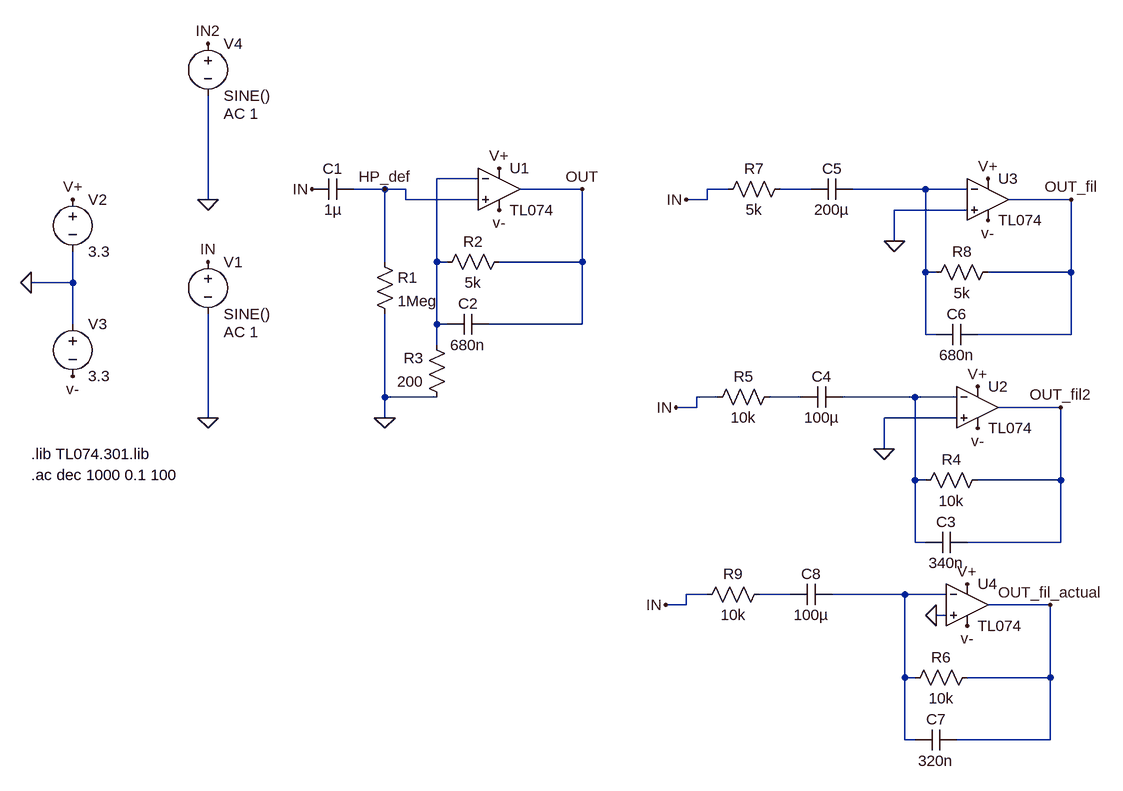
[diagram p0: schematic capstone_filter_only.asc]
capstone_filter_only.asc, the LTspice schematic file:
Version 4
SHEET 1 1804 912
WIRE 272 0 208 0
WIRE 128 16 80 16
WIRE 160 16 128 16
WIRE 432 16 336 16
WIRE 656 16 624 16
WIRE 784 16 736 16
WIRE 960 16 848 16
WIRE 1024 16 960 16
WIRE -144 32 -144 -128
WIRE 160 32 160 16
WIRE 272 32 160 32
WIRE 624 32 624 16
WIRE 624 32 592 32
WIRE 1184 32 1088 32
WIRE 1024 48 912 48
WIRE 912 96 912 48
WIRE 128 128 128 16
WIRE 208 128 208 0
WIRE 224 128 208 128
WIRE 432 128 432 16
WIRE 432 128 304 128
WIRE 960 144 960 16
WIRE 976 144 960 144
WIRE 1184 144 1184 32
WIRE 1184 144 1056 144
WIRE -352 160 -352 112
WIRE -352 160 -416 160
WIRE -352 224 -352 160
WIRE 208 224 208 128
WIRE 224 224 208 224
WIRE 432 224 432 128
WIRE 432 224 288 224
WIRE 960 240 960 144
WIRE 976 240 960 240
WIRE 1184 240 1184 144
WIRE 1184 240 1040 240
WIRE 208 256 208 224
WIRE 128 336 128 208
WIRE 208 336 128 336
WIRE 640 336 608 336
WIRE 768 336 720 336
WIRE 944 336 832 336
WIRE 1008 336 944 336
WIRE 608 352 608 336
WIRE 608 352 576 352
WIRE 1168 352 1072 352
WIRE -144 368 -144 208
WIRE 128 368 128 336
WIRE 1008 368 896 368
WIRE 896 416 896 368
WIRE 944 464 944 336
WIRE 960 464 944 464
WIRE 1168 464 1168 352
WIRE 1168 464 1040 464
WIRE 944 560 944 464
WIRE 960 560 944 560
WIRE 1168 560 1168 464
WIRE 1168 560 1024 560
WIRE 624 640 592 640
WIRE 752 640 704 640
WIRE 928 640 816 640
WIRE 992 640 928 640
WIRE 592 656 592 640
WIRE 592 656 560 656
WIRE 1152 656 1056 656
WIRE 992 672 976 672
WIRE 928 768 928 640
WIRE 944 768 928 768
WIRE 1152 768 1152 656
WIRE 1152 768 1024 768
WIRE 928 864 928 768
WIRE 944 864 928 864
WIRE 1152 864 1152 768
WIRE 1152 864 1008 864
FLAG 304 -16 V+
FLAG 304 48 v-
FLAG 432 16 OUT
FLAG -144 368 0
FLAG -416 160 0
FLAG -352 32 V+
FLAG -352 304 v-
FLAG -144 128 IN
FLAG 16 16 IN
FLAG 128 368 0
FLAG 1056 0 V+
FLAG 1056 64 v-
FLAG 1184 32 OUT_fil
FLAG 592 32 IN
FLAG 128 16 HP_def
FLAG -144 32 0
FLAG -144 -208 IN2
FLAG 912 96 0
FLAG 1040 320 V+
FLAG 1040 384 v-
FLAG 1168 352 OUT_fil2
FLAG 576 352 IN
FLAG 896 416 0
FLAG 1024 624 V+
FLAG 1024 688 v-
FLAG 1152 656 OUT_fil_actual
FLAG 560 656 IN
FLAG 976 672 0
SYMBOL OpAmps\\opamp2 304 -48 R0
SYMATTR InstName U1
SYMATTR Value TL074
SYMBOL cap 80 0 R90
WINDOW 0 0 32 VBottom 2
WINDOW 3 32 32 VTop 2
SYMATTR InstName C1
SYMATTR Value 1µ
SYMBOL res 112 112 R0
SYMATTR InstName R1
SYMATTR Value 1Meg
SYMBOL res 320 112 R90
WINDOW 0 0 56 VBottom 2
WINDOW 3 32 56 VTop 2
SYMATTR InstName R2
SYMATTR Value 5k
SYMBOL res 224 352 R180
WINDOW 0 36 76 Left 2
WINDOW 3 36 40 Left 2
SYMATTR InstName R3
SYMATTR Value 200
SYMBOL cap 288 208 R90
WINDOW 0 0 32 VBottom 2
WINDOW 3 32 32 VTop 2
SYMATTR InstName C2
SYMATTR Value 680n
SYMBOL voltage -144 112 R0
WINDOW 123 24 124 Left 2
WINDOW 39 0 0 Left 0
SYMATTR Value2 AC 1
SYMATTR InstName V1
SYMATTR Value SINE()
SYMBOL voltage -352 16 R0
SYMATTR InstName V2
SYMATTR Value 3.3
SYMBOL voltage -352 208 R0
SYMATTR InstName V3
SYMATTR Value 3.3
SYMBOL OpAmps\\opamp2 1056 -32 R0
SYMATTR InstName U3
SYMATTR Value TL074
SYMBOL res 1072 128 R90
WINDOW 0 0 56 VBottom 2
WINDOW 3 32 56 VTop 2
SYMATTR InstName R8
SYMATTR Value 5k
SYMBOL cap 1040 224 R90
WINDOW 0 0 32 VBottom 2
WINDOW 3 32 32 VTop 2
SYMATTR InstName C6
SYMATTR Value 680n
SYMBOL res 752 0 R90
WINDOW 0 0 56 VBottom 2
WINDOW 3 32 56 VTop 2
SYMATTR InstName R7
SYMATTR Value 5k
SYMBOL cap 848 0 R90
WINDOW 0 0 32 VBottom 2
WINDOW 3 32 32 VTop 2
SYMATTR InstName C5
SYMATTR Value 200µ
SYMBOL voltage -144 -224 R0
WINDOW 123 24 124 Left 2
WINDOW 39 0 0 Left 0
SYMATTR Value2 AC 1
SYMATTR InstName V4
SYMATTR Value SINE()
SYMBOL OpAmps\\opamp2 1040 288 R0
SYMATTR InstName U2
SYMATTR Value TL074
SYMBOL res 1056 448 R90
WINDOW 0 0 56 VBottom 2
WINDOW 3 32 56 VTop 2
SYMATTR InstName R4
SYMATTR Value 10k
SYMBOL cap 1024 544 R90
WINDOW 0 0 32 VBottom 2
WINDOW 3 32 32 VTop 2
SYMATTR InstName C3
SYMATTR Value 340n
SYMBOL res 736 320 R90
WINDOW 0 0 56 VBottom 2
WINDOW 3 32 56 VTop 2
SYMATTR InstName R5
SYMATTR Value 10k
SYMBOL cap 832 320 R90
WINDOW 0 0 32 VBottom 2
WINDOW 3 32 32 VTop 2
SYMATTR InstName C4
SYMATTR Value 100µ
SYMBOL OpAmps\\opamp2 1024 592 R0
SYMATTR InstName U4
SYMATTR Value TL074
SYMBOL res 1040 752 R90
WINDOW 0 0 56 VBottom 2
WINDOW 3 32 56 VTop 2
SYMATTR InstName R6
SYMATTR Value 10k
SYMBOL cap 1008 848 R90
WINDOW 0 0 32 VBottom 2
WINDOW 3 32 32 VTop 2
SYMATTR InstName C7
SYMATTR Value 320n
SYMBOL res 720 624 R90
WINDOW 0 0 56 VBottom 2
WINDOW 3 32 56 VTop 2
SYMATTR InstName R9
SYMATTR Value 10k
SYMBOL cap 816 624 R90
WINDOW 0 0 32 VBottom 2
WINDOW 3 32 32 VTop 2
SYMATTR InstName C8
SYMATTR Value 100µ
TEXT -416 424 Left 2 !.lib TL074.301.lib
TEXT -416 456 Left 2 !.ac dec 1000 0.1 100

The netlist it stands for:
* capstone_filter_only.asc
XU1 HP_def N001 V+ v- OUT TL074  ; pins In+ In- V+ V- OUT
C1 HP_def IN 1µ
R1 HP_def 0 1Meg
R2 OUT N001 5k
R3 0 N001 200
C2 OUT N001 680n
V1 IN 0 SINE() AC 1
V2 V+ 0 3.3
V3 0 v- 3.3
XU3 0 N003 V+ v- OUT_fil TL074  ; pins In+ In- V+ V- OUT
R8 OUT_fil N003 5k
C6 OUT_fil N003 680n
R7 N002 IN 5k
C5 N003 N002 200µ
V4 IN2 0 SINE() AC 1
XU2 0 N005 V+ v- OUT_fil2 TL074  ; pins In+ In- V+ V- OUT
R4 OUT_fil2 N005 10k
C3 OUT_fil2 N005 340n
R5 N004 IN 10k
C4 N005 N004 100µ
XU4 0 N007 V+ v- OUT_fil_actual TL074  ; pins In+ In- V+ V- OUT
R6 OUT_fil_actual N007 10k
C7 OUT_fil_actual N007 320n
R9 N006 IN 10k
C8 N007 N006 100µ
.lib TL074.301.lib
.ac dec 1000 0.1 100
.backanno
.end